# EAGLE schematic sunbeam2 (EAGLE 6.0)
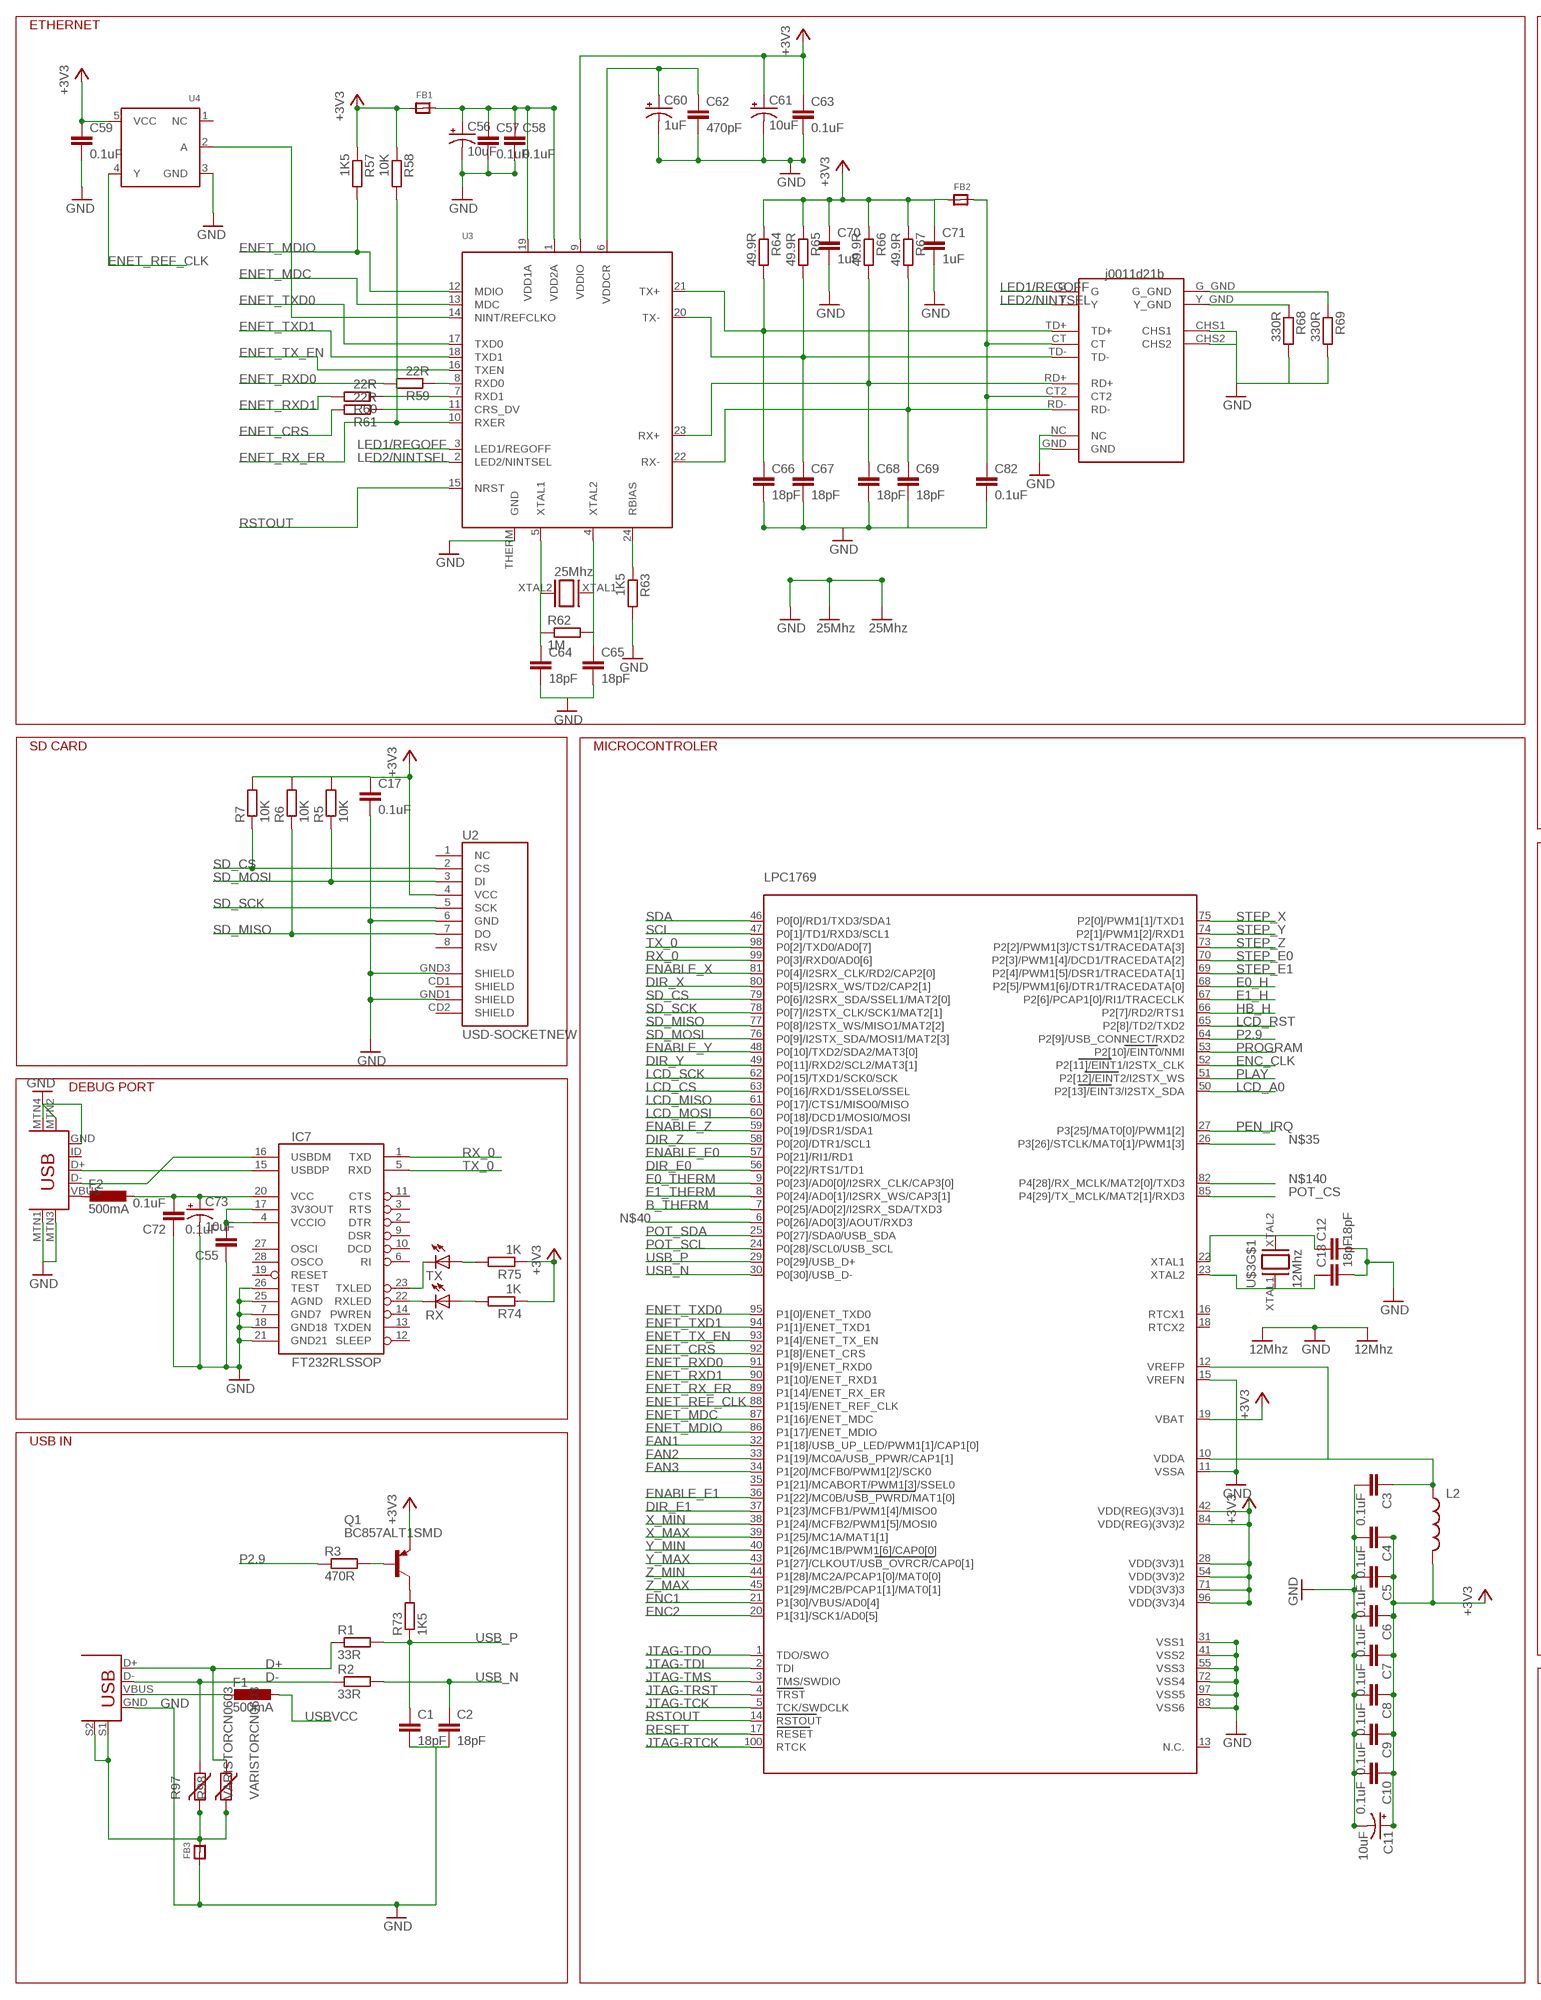
[diagram p0: schematic, sheet 1, part 1 of 2]
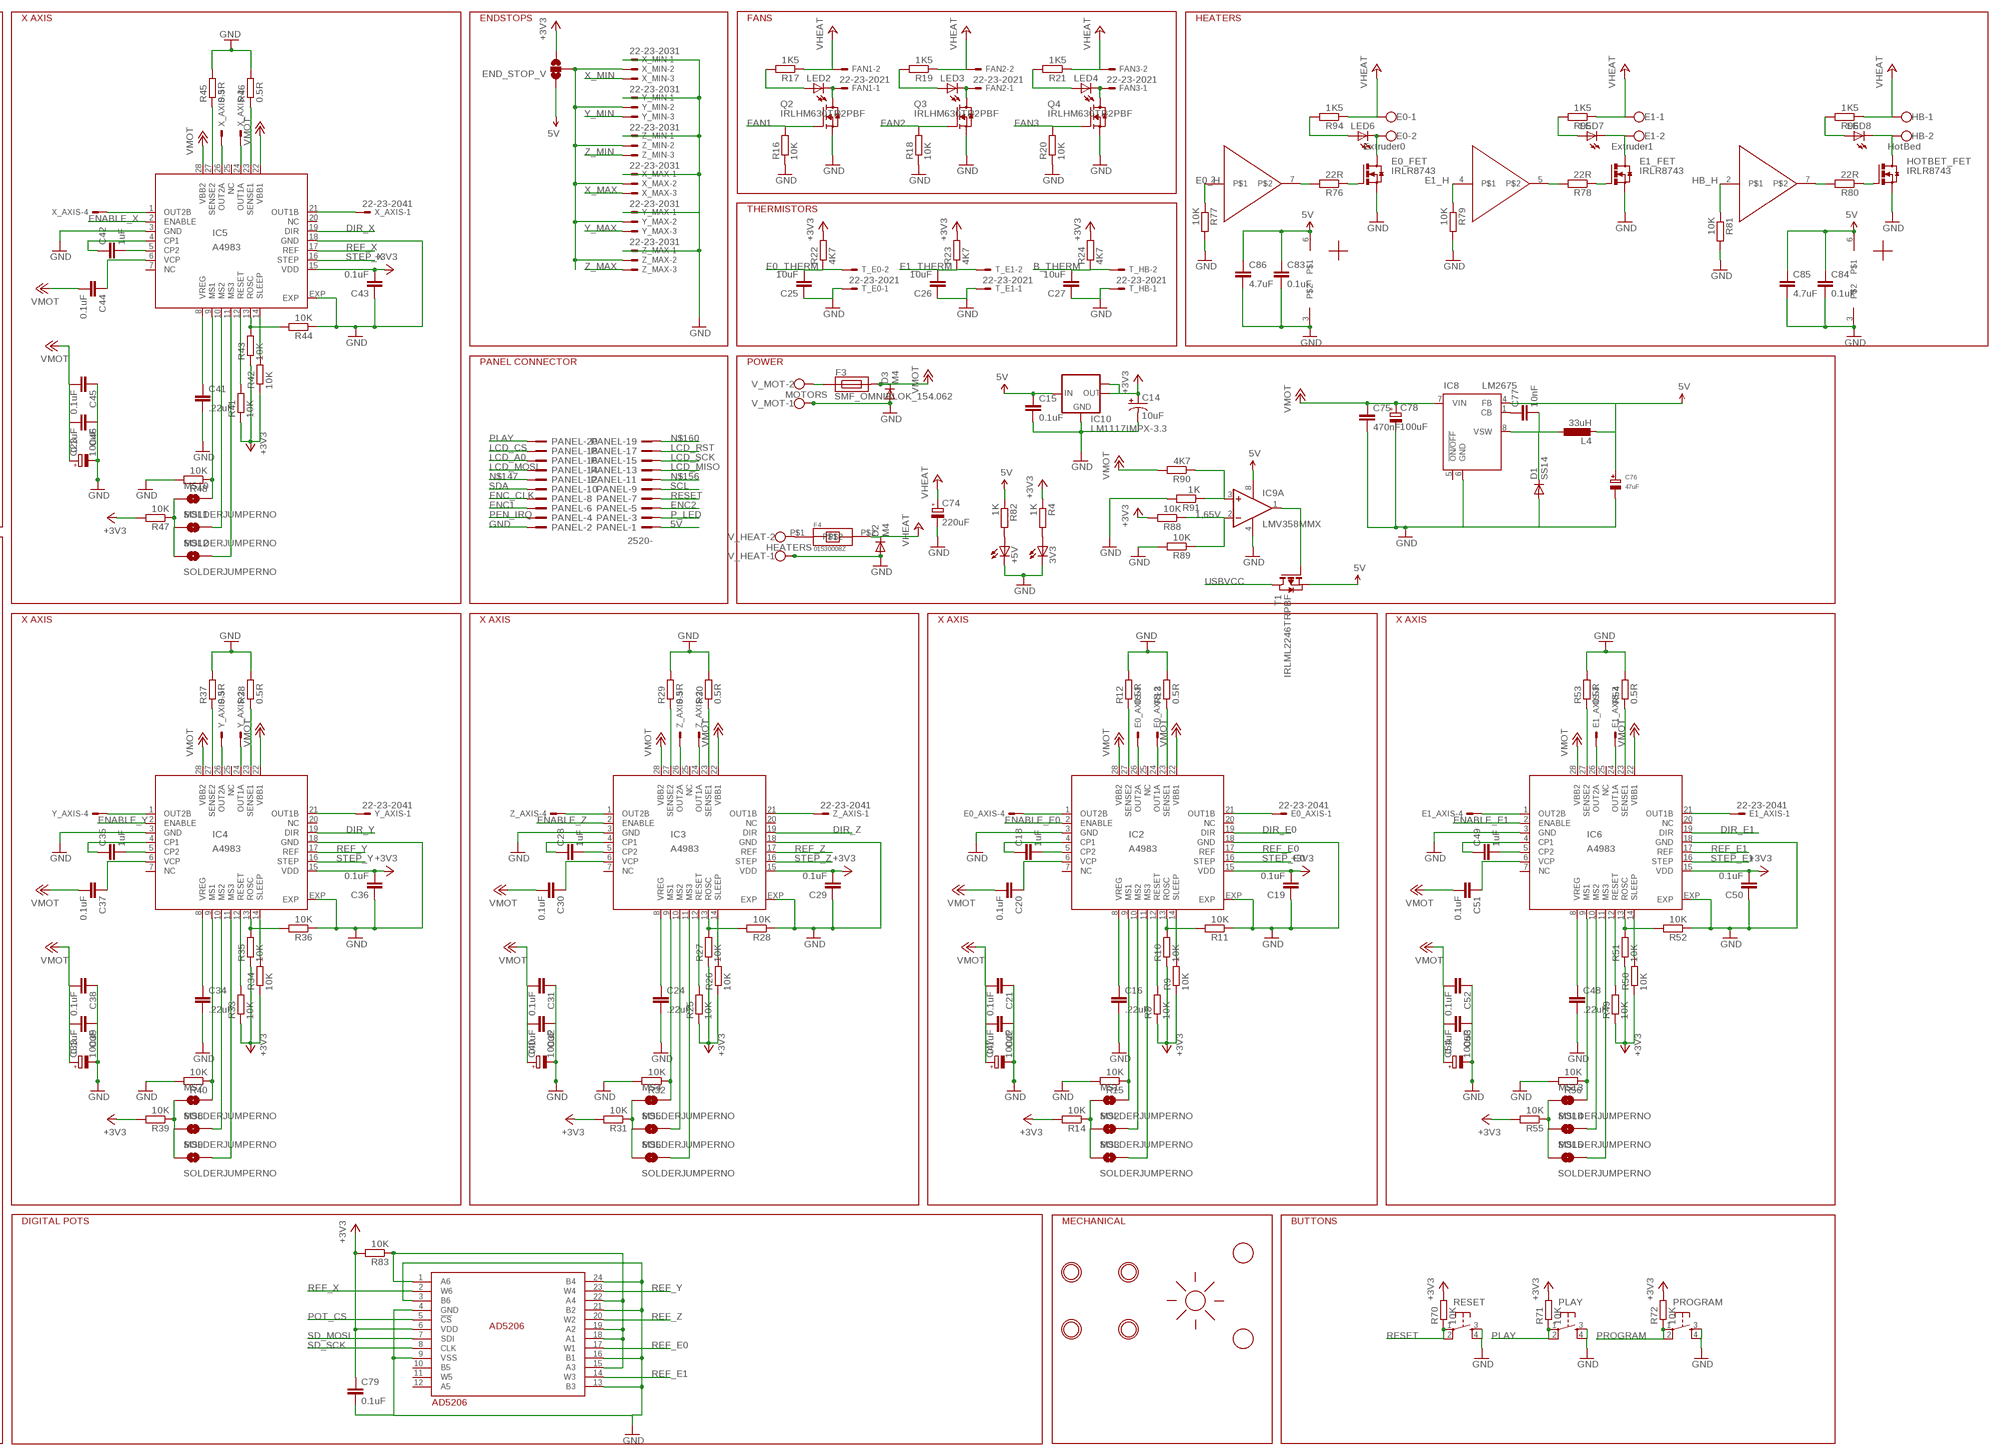
[diagram p1: schematic, sheet 1, part 2 of 2]

## Parts
3V3  LEDCHIPLED_0805  [CHIPLED_0805]
+5V  LEDCHIPLED_0805  [CHIPLED_0805]
AD5206  AD5206  [TSSOP24]
C1  18pF  C-EUC0603  [C0603]
C2  18pF  C-EUC0603  [C0603]
C3  0.1uF  C-EUC0603  [C0603]
C4  0.1uF  C-EUC0603  [C0603]
C5  0.1uF  C-EUC0603  [C0603]
C6  0.1uF  C-EUC0603  [C0603]
C7  0.1uF  C-EUC0603  [C0603]
C8  0.1uF  C-EUC0603  [C0603]
C9  0.1uF  C-EUC0603  [C0603]
C10  0.1uF  C-EUC0603  [C0603]
C11  10uF  CAP_POL1206  [EIA3216]
C12  18pF  C-EUC0603  [C0603]
C13  18pF  C-EUC0603  [C0603]
C14  10uF  CAP_POL1206  [EIA3216]
C15  0.1uF  C-EUC0805  [C0805]
C16  .22uF  C-EUC0603  [C0603]
C17  0.1uF  C-EUC0603  [C0603]
C18  1uF  C-EUC0603  [C0603]
C19  0.1uF  C-EUC0603  [C0603]
C20  0.1uF  C-EUC0805  [C0805]
C21  0.1uF  C-EUC0805  [C0805]
C22  0.1uF  C-EUC0805  [C0805]
C23  100uF  CPOL-EUUD-6,3X7,7  [UD-6,3X7,7_NICHICON]
C24  .22uF  C-EUC0603  [C0603]
C25  10uF  C-EUC0603  [C0603]
C26  10uF  C-EUC0603  [C0603]
C27  10uF  C-EUC0603  [C0603]
C28  1uF  C-EUC0603  [C0603]
C29  0.1uF  C-EUC0603  [C0603]
C30  0.1uF  C-EUC0805  [C0805]
C31  0.1uF  C-EUC0805  [C0805]
C32  0.1uF  C-EUC0805  [C0805]
C33  100uF  CPOL-EUUD-6,3X7,7  [UD-6,3X7,7_NICHICON]
C34  .22uF  C-EUC0603  [C0603]
C35  1uF  C-EUC0603  [C0603]
C36  0.1uF  C-EUC0603  [C0603]
C37  0.1uF  C-EUC0805  [C0805]
C38  0.1uF  C-EUC0805  [C0805]
C39  0.1uF  C-EUC0805  [C0805]
C40  100uF  CPOL-EUUD-6,3X7,7  [UD-6,3X7,7_NICHICON]
C41  .22uF  C-EUC0603  [C0603]
C42  1uF  C-EUC0603  [C0603]
C43  0.1uF  C-EUC0603  [C0603]
C44  0.1uF  C-EUC0805  [C0805]
C45  0.1uF  C-EUC0805  [C0805]
C46  0.1uF  C-EUC0805  [C0805]
C47  100uF  CPOL-EUUD-6,3X7,7  [UD-6,3X7,7_NICHICON]
C48  .22uF  C-EUC0603  [C0603]
C49  1uF  C-EUC0603  [C0603]
C50  0.1uF  C-EUC0603  [C0603]
C51  0.1uF  C-EUC0805  [C0805]
C52  0.1uF  C-EUC0805  [C0805]
C53  0.1uF  C-EUC0805  [C0805]
C54  100uF  CPOL-EUUD-6,3X7,7  [UD-6,3X7,7_NICHICON]
C55  0.1uF  C-EUC0603  [C0603]
C56  10uF  CAP_POL1206  [EIA3216]
C57  0.1uF  C-EUC0603  [C0603]
C58  0.1uF  C-EUC0603  [C0603]
C59  0.1uF  C-EUC0603  [C0603]
C60  1uF  CAP_POL1206  [EIA3216]
C61  10uF  CAP_POL1206  [EIA3216]
C62  470pF  C-EUC0603  [C0603]
C63  0.1uF  C-EUC0603  [C0603]
C64  18pF  C-EUC0603  [C0603]
C65  18pF  C-EUC0603  [C0603]
C66  18pF  C-EUC0603  [C0603]
C67  18pF  C-EUC0603  [C0603]
C68  18pF  C-EUC0603  [C0603]
C69  18pF  C-EUC0603  [C0603]
C70  1uF  C-EUC0603  [C0603]
C71  1uF  C-EUC0603  [C0603]
C72  0.1uF  C-EUC0603  [C0603]
C73  10uF  CAP_POL1206  [EIA3216]
C74  220uF  CPOL-EUUD-8X10  [UD-8X10_NICHICON]
C75  470nF  C-EUC0805  [C0805]
C76  47uF  CAP_TANTALUMD/7343_REFLOW  [EIA7343-31/D-R]
C77  10nF  C-EUC0805  [C0805]
C78  100uF  CPOL-EUUD-8X10  [UD-8X10_NICHICON]
C79  0.1uF  C-EUC0603  [C0603]
C82  0.1uF  C-EUC0603  [C0603]
C83  0.1uF  C-EUC0603  [C0603]
C84  0.1uF  C-EUC0603  [C0603]
C85  4.7uF  C-EUC0603  [C0603]
C86  4.7uF  C-EUC0603  [C0603]
D1  SS14  DIODE-DO214AC  [DO214AC]
D2  M4  DIODE-DO214AC  [DO214AC]
D3  M4  DIODE-DO214AC  [DO214AC]
E0  Extruder0  W237-102  [W237-102]
E0_AXIS  22-23-2041  [22-23-2041]
E0_FET  IRLR8743  [D-PAK_TO252AA]
E1  Extruder1  W237-102  [W237-102]
E1_AXIS  22-23-2041  [22-23-2041]
E1_FET  IRLR8743  [D-PAK_TO252AA]
END_STOP_V  SOLDERJUMPER_2WAYS  [SJ_3]
F1  500mA  L-EUL1812  [L1812]
F2  500mA  L-EUL1812  [L1812]
F3  SMF_OMNIBLOK_154.062  [NANO2_SMF_FUSEBLOCK]
F4  01530008Z  [01530008Z]
FAN1  22-23-2021  [22-23-2021]
FAN2  22-23-2021  [22-23-2021]
FAN3  22-23-2021  [22-23-2021]
FB1  FERRITE_0603  [_0603]
FB2  FERRITE_0603  [_0603]
FB3  FERRITE_0603  [_0603]
FET_DRV1  TC4427  [SOIC8]
FET_DRV2  TC4427  [SOIC8]
GND  MOUNTINGHOLE3.0THIN  [MOUNTINGHOLE_3.0_PLATEDTHIN]
HB  HotBed  W237-102  [W237-102]
HOTBET_FET  IRLR8743  [D-PAK_TO252AA]
IC2  A4983  [QFN28ET]
IC3  A4983  [QFN28ET]
IC4  A4983  [QFN28ET]
IC5  A4983  [QFN28ET]
IC6  A4983  [QFN28ET]
IC7  FT232RLSSOP  [SSOP28DB]
IC8  LM2675  [SO08]
IC9  LMV358MMX  [MSOP08]
IC10  LM1117IMPX-3.3  [SOT223]
L2  INDUCTOR0603  [0603]
L4  33uH  L-EUPIS2816  [PIS2816]
LED2  LEDCHIPLED_0805  [CHIPLED_0805]
LED3  LEDCHIPLED_0805  [CHIPLED_0805]
LED4  LEDCHIPLED_0805  [CHIPLED_0805]
LED6  LEDCHIPLED_0805  [CHIPLED_0805]
LED7  LEDCHIPLED_0805  [CHIPLED_0805]
LED8  LEDCHIPLED_0805  [CHIPLED_0805]
LPC1769  LPC1768  [LQFP100]
MS1  SOLDERJUMPERNO  [SJ_2S-NO]
MS2  SOLDERJUMPERNO  [SJ_2S-NO]
MS3  SOLDERJUMPERNO  [SJ_2S-NO]
MS4  SOLDERJUMPERNO  [SJ_2S-NO]
MS5  SOLDERJUMPERNO  [SJ_2S-NO]
MS6  SOLDERJUMPERNO  [SJ_2S-NO]
MS7  SOLDERJUMPERNO  [SJ_2S-NO]
MS8  SOLDERJUMPERNO  [SJ_2S-NO]
MS9  SOLDERJUMPERNO  [SJ_2S-NO]
MS10  SOLDERJUMPERNO  [SJ_2S-NO]
MS11  SOLDERJUMPERNO  [SJ_2S-NO]
MS12  SOLDERJUMPERNO  [SJ_2S-NO]
MS13  SOLDERJUMPERNO  [SJ_2S-NO]
MS14  SOLDERJUMPERNO  [SJ_2S-NO]
MS15  SOLDERJUMPERNO  [SJ_2S-NO]
PANEL  2520-  [PAK100/2500-20]
PLAY  TAC_SWITCHSMD  [TACTILE_SWITCH_SMD]
PROGRAM  TAC_SWITCHSMD  [TACTILE_SWITCH_SMD]
Q1  BC857ALT1SMD  [SOT23-BEC]
Q2  IRLHM630TR2PBF  IRLHM630PBF  [PQFN33]
Q3  IRLHM630TR2PBF  IRLHM630PBF  [PQFN33]
Q4  IRLHM630TR2PBF  IRLHM630PBF  [PQFN33]
R1  33R  R-EU_R0603  [R0603]
R2  33R  R-EU_R0603  [R0603]
R3  470R  R-EU_R0603  [R0603]
R4  1K  R-EU_R0603  [R0603]
R5  10K  R-EU_R0603  [R0603]
R6  10K  R-EU_R0603  [R0603]
R7  10K  R-EU_R0603  [R0603]
R8  10K  R-EU_R0603  [R0603]
R9  10K  R-EU_R0603  [R0603]
R10  10K  R-EU_R0603  [R0603]
R11  10K  R-EU_R0603  [R0603]
R12  0.5R  R-EU_R2512  [R2512]
R13  0.5R  R-EU_R2512  [R2512]
R14  10K  R-EU_R0603  [R0603]
R15  10K  R-EU_R0603  [R0603]
R16  10K  R-EU_R0603  [R0603]
R17  1K5  R-EU_R0603  [R0603]
R18  10K  R-EU_R0603  [R0603]
R19  1K5  R-EU_R0603  [R0603]
R20  10K  R-EU_R0603  [R0603]
R21  1K5  R-EU_R0603  [R0603]
R22  4K7  R-EU_R0603  [R0603]
R23  4K7  R-EU_R0603  [R0603]
R24  4K7  R-EU_R0603  [R0603]
R25  10K  R-EU_R0603  [R0603]
R26  10K  R-EU_R0603  [R0603]
R27  10K  R-EU_R0603  [R0603]
R28  10K  R-EU_R0603  [R0603]
R29  0.5R  R-EU_R2512  [R2512]
R30  0.5R  R-EU_R2512  [R2512]
R31  10K  R-EU_R0603  [R0603]
R32  10K  R-EU_R0603  [R0603]
R33  10K  R-EU_R0603  [R0603]
R34  10K  R-EU_R0603  [R0603]
R35  10K  R-EU_R0603  [R0603]
R36  10K  R-EU_R0603  [R0603]
R37  0.5R  R-EU_R2512  [R2512]
R38  0.5R  R-EU_R2512  [R2512]
R39  10K  R-EU_R0603  [R0603]
R40  10K  R-EU_R0603  [R0603]
R41  10K  R-EU_R0603  [R0603]
R42  10K  R-EU_R0603  [R0603]
R43  10K  R-EU_R0603  [R0603]
R44  10K  R-EU_R0603  [R0603]
R45  0.5R  R-EU_R2512  [R2512]
R46  0.5R  R-EU_R2512  [R2512]
R47  10K  R-EU_R0603  [R0603]
R48  10K  R-EU_R0603  [R0603]
R49  10K  R-EU_R0603  [R0603]
R50  10K  R-EU_R0603  [R0603]
R51  10K  R-EU_R0603  [R0603]
R52  10K  R-EU_R0603  [R0603]
R53  0.5R  R-EU_R2512  [R2512]
R54  0.5R  R-EU_R2512  [R2512]
R55  10K  R-EU_R0603  [R0603]
R56  10K  R-EU_R0603  [R0603]
R57  1K5  R-EU_R0603  [R0603]
R58  10K  R-EU_R0603  [R0603]
R59  22R  R-EU_R0603  [R0603]
R60  22R  R-EU_R0603  [R0603]
R61  22R  R-EU_R0603  [R0603]
R62  1M  R-EU_R0603  [R0603]
R63  1K5  R-EU_R0603  [R0603]
R64  49.9R  R-EU_R0603  [R0603]
R65  49.9R  R-EU_R0603  [R0603]
R66  49.9R  R-EU_R0603  [R0603]
R67  49.9R  R-EU_R0603  [R0603]
R68  330R  R-EU_R0603  [R0603]
R69  330R  R-EU_R0603  [R0603]
R70  10K  R-EU_R0603  [R0603]
R71  10K  R-EU_R0603  [R0603]
R72  10K  R-EU_R0603  [R0603]
R73  1K5  R-EU_R0603  [R0603]
R74  1K  R-EU_R0603  [R0603]
R75  1K  R-EU_R0603  [R0603]
R76  22R  R-EU_R0603  [R0603]
R77  10K  R-EU_R0603  [R0603]
R78  22R  R-EU_R0603  [R0603]
R79  10K  R-EU_R0603  [R0603]
R80  22R  R-EU_R0603  [R0603]
R81  10K  R-EU_R0603  [R0603]
R82  1K  R-EU_R0603  [R0603]
R83  10K  R-EU_R0603  [R0603]
R88  10K  R-EU_R0603  [R0603]
R89  10K  R-EU_R0603  [R0603]
R90  4K7  R-EU_R0603  [R0603]
R91  1K  R-EU_R0603  [R0603]
R94  1K5  R-EU_R0603  [R0603]
R95  1K5  R-EU_R0603  [R0603]
R96  1K5  R-EU_R0603  [R0603]
R97  VARISTORCN0603  [CT/CN0603]
R98  VARISTORCN0603  [CT/CN0603]
RESET  TAC_SWITCHSMD  [TACTILE_SWITCH_SMD]
RJ1  ETHERNET  J0011D21B  [J0011D21B]
RX  LEDCHIPLED_0805  [CHIPLED_0805]
T1  IRLML2246TRPBF  PMOSSOT23  [SOT-23]
T_E0  22-23-2021  [22-23-2021]
T_E1  22-23-2021  [22-23-2021]
T_HB  22-23-2021  [22-23-2021]
TX  LEDCHIPLED_0805  [CHIPLED_0805]
U2  USD-SOCKETNEW  [MICRO-SD-SOCKET-PP]
U3  LAN8720  [QFN24_4MM]
U4  74LVC1G04  [SOT23-5]
U$1  USB+SHIELD  [USB-B-PTH]
U$3  12Mhz  CRYSTAL2734  [CRYSTAL2734]
U$7  USB-MINIB-5PIN  [USB-MINIB]
U$8  25Mhz  CRYSTAL2734  [CRYSTAL2734]
U$17  MOUNTINGHOLE3.0THIN  [MOUNTINGHOLE_3.0_PLATEDTHIN]
U$18  MOUNTINGHOLE3.0THIN  [MOUNTINGHOLE_3.0_PLATEDTHIN]
U$20  MOUNTINGHOLE3.0THIN  [MOUNTINGHOLE_3.0_PLATEDTHIN]
U$21  SUNLOGO  [SUN]
U$22  FIDUCIAL  [FIDUCIAL_1MM]
U$23  FIDUCIAL  [FIDUCIAL_1MM]
V_HEAT  HEATERS  W237-102  [W237-102]
V_MOT  MOTORS  W237-102  [W237-102]
X_AXIS  22-23-2041  [22-23-2041]
X_MAX  22-23-2031  [22-23-2031]
X_MIN  22-23-2031  [22-23-2031]
Y_AXIS  22-23-2041  [22-23-2041]
Y_MAX  22-23-2031  [22-23-2031]
Y_MIN  22-23-2031  [22-23-2031]
Z_AXIS  22-23-2041  [22-23-2041]
Z_MAX  22-23-2031  [22-23-2031]
Z_MIN  22-23-2031  [22-23-2031]

## Nets
1,65V: IC9.2(A:-IN) R88.1 R89.1
5V: C15.1 C76.+ C83.1 C84.1 C85.1 C86.1 END_STOP_V.1 FET_DRV1.6 FET_DRV2.6 IC8.4(FB) IC9.8(P:V+) IC10.3(IN) L4.2 PANEL.1 R82.1 T1.2(S)
+3V3: AD5206.6(VDD) C4.1 C5.1 C6.1 C7.1 C8.1 C9.1 C10.1 C11.A(+) C14.A(+) C17.1 C19.2 C29.2 C36.2 C43.2 C50.2 C59.1 C61.A(+) C63.1 C70.1 C71.1 C79.1 END_STOP_V.3 FB1.1 FB2.1 IC2.15(VDD) IC3.15(VDD) IC4.15(VDD) IC5.15(VDD) IC6.15(VDD) IC10.2(OUT) IC10.TAB(OUT1) L2.2 LPC1769.19(VBAT) LPC1769.28(VDD(3V3)1) LPC1769.42(VDD(REG)(3V3)1) LPC1769.54(VDD(3V3)2) LPC1769.71(VDD(3V3)3) LPC1769.84(VDD(REG)(3V3)2) LPC1769.96(VDD(3V3)4) Q1.E R4.1 R5.2 R6.2 R7.2 R8.1 R9.1 R10.1 R14.2 R22.2 R23.2 R24.2 R25.1 R26.1 R27.1 R31.2 R33.1 R34.1 R35.1 R39.2 R41.1 R42.1 R43.1 R47.2 R49.1 R50.1 R51.1 R55.2 R57.1 R58.1 R64.1 R65.1 R66.1 R67.1 R70.2 R71.2 R72.2 R74.1 R75.1 R83.2 R88.2 U2.4(VCC) U3.9(VDDIO) U4.5(VCC)
+12V: C20.2 C21.2 C22.2 C23.+ C30.2 C31.2 C32.2 C33.+ C37.2 C38.2 C39.2 C40.+ C44.2 C45.2 C46.2 C47.+ C51.2 C52.2 C53.2 C54.+ C75.1 C78.+ D3.C F3.2 IC2.22(VBB1) IC2.28(VBB2) IC3.22(VBB1) IC3.28(VBB2) IC4.22(VBB1) IC4.28(VBB2) IC5.22(VBB1) IC5.28(VBB2) IC6.22(VBB1) IC6.28(VBB2) IC8.7(VIN) R90.2 ; supply symbol labelled VMOT
B_THERM: C27.2 LPC1769.7(P0[25]/AD0[2]/I2SRX_SDA/TXD3) R24.1 T_HB.2
D+: R1.1 R98.1 U$1.D+
D-: R2.1 R97.1 U$1.D-
DIR_E0: IC2.19(DIR) LPC1769.56(P0[22]/RTS1/TD1)
DIR_E1: IC6.19(DIR) LPC1769.37(P1[23]/MCFB1/PWM1[4]/MISO0)
DIR_X: IC5.19(DIR) LPC1769.80(P0[5]/I2SRX_WS/TD2/CAP2[1])
DIR_Y: IC4.19(DIR) LPC1769.49(P0[11]/RXD2/SCL2/MAT3[1])
DIR_Z: IC3.19(DIR) LPC1769.58(P0[20]/DTR1/SCL1)
E0_H: FET_DRV1.2 LPC1769.68(P2[5]/PWM1[6]/DTR1/TRACEDATA[0]) R77.1
E0_THERM: C25.2 LPC1769.9(P0[23]/AD0[0]/I2SRX_CLK/CAP3[0]) R22.1 T_E0.2
E1_H: FET_DRV1.4 LPC1769.67(P2[6]/PCAP1[0]/RI1/TRACECLK) R79.1
E1_THERM: C26.2 LPC1769.8(P0[24]/AD0[1]/I2SRX_WS/CAP3[1]) R23.1 T_E1.2
ENABLE_E0: IC2.2(ENABLE) LPC1769.57(P0[21]/RI1/RD1)
ENABLE_E1: IC6.2(ENABLE) LPC1769.36(P1[22]/MC0B/USB_PWRD/MAT1[0])
ENABLE_X: IC5.2(ENABLE) LPC1769.81(P0[4]/I2SRX_CLK/RD2/CAP2[0])
ENABLE_Y: IC4.2(ENABLE) LPC1769.48(P0[10]/TXD2/SDA2/MAT3[0])
ENABLE_Z: IC3.2(ENABLE) LPC1769.59(P0[19]/DSR1/SDA1)
ENC1: LPC1769.21(P1[30]/VBUS/AD0[4]) PANEL.6
ENC2: LPC1769.20(P1[31]/SCK1/AD0[5]) PANEL.5
ENC_CLK: LPC1769.52(P2[11]/EINT1/I2STX_CLK) PANEL.8
ENET_CRS: LPC1769.92(P1[8]/ENET_CRS) R61.2
ENET_MDC: LPC1769.87(P1[16]/ENET_MDC) U3.13(MDC)
ENET_MDIO: LPC1769.86(P1[17]/ENET_MDIO) R57.2 U3.12(MDIO)
ENET_REF_CLK: LPC1769.88(P1[15]/ENET_REF_CLK) U4.4(Y)
ENET_RX_ER: LPC1769.89(P1[14]/ENET_RX_ER) R58.2 U3.10(RXER)
ENET_RXD0: LPC1769.91(P1[9]/ENET_RXD0) R59.2
ENET_RXD1: LPC1769.90(P1[10]/ENET_RXD1) R60.2
ENET_TX_EN: LPC1769.93(P1[4]/ENET_TX_EN) U3.16(TXEN)
ENET_TXD0: LPC1769.95(P1[0]/ENET_TXD0) U3.17(TXD0)
ENET_TXD1: LPC1769.94(P1[1]/ENET_TXD1) U3.18(TXD1)
FAN1: LPC1769.32(P1[18]/USB_UP_LED/PWM1[1]/CAP1[0]) Q2.G R16.2
FAN2: LPC1769.33(P1[19]/MC0A/USB_PPWR/CAP1[1]) Q3.G R18.2
FAN3: LPC1769.34(P1[20]/MCFB0/PWM1[2]/SCK0) Q4.G R20.2
GND: 3V3.C +5V.C AD5206.3(B6) AD5206.4(GND) AD5206.9(VSS) AD5206.13(B3) AD5206.16(B1) AD5206.21(B2) AD5206.24(B4) C1.2 C2.2 C3.2 C4.2 C5.2 C6.2 C7.2 C8.2 C9.2 C10.2 C11.C(-) C12.2 C13.2 C14.C(-) C15.2 C16.2 C17.2 C19.1 C21.1 C22.1 C23.- C24.2 C25.1 C26.1 C27.1 C29.1 C31.1 C32.1 C33.- C34.2 C36.1 C38.1 C39.1 C40.- C41.2 C43.1 C45.1 C46.1 C47.- C48.2 C50.1 C52.1 C53.1 C54.- C55.1 C56.C(-) C57.2 C58.2 C59.2 C60.C(-) C61.C(-) C62.2 C63.2 C64.2 C65.2 C66.2 C67.2 C68.2 C69.2 C70.2 C71.2 C72.1 C73.C(-) C74.- C75.2 C76.- C78.- C79.2 C82.2 C83.2 C84.2 C85.2 C86.2 D1.A D2.A D3.A E0_FET.3(S) E1_FET.3(S) FB3.1 FET_DRV1.3 FET_DRV2.3 HOTBET_FET.3(S) IC2.3(GND) IC2.18(GND) IC2.EXP IC3.3(GND) IC3.18(GND) IC3.EXP IC4.3(GND) IC4.18(GND) IC4.EXP IC5.3(GND) IC5.18(GND) IC5.EXP IC6.3(GND) IC6.18(GND) IC6.EXP IC7.7(GND7) IC7.18(GND18) IC7.21(GND21) IC7.25(AGND) IC7.26(TEST) IC8.6(GND) IC9.4(P:V-) IC10.1(GND) LPC1769.11(VSSA) LPC1769.15(VREFN) LPC1769.31(VSS1) LPC1769.41(VSS2) LPC1769.55(VSS3) LPC1769.72(VSS4) LPC1769.83(VSS6) LPC1769.97(VSS5) PANEL.2 PLAY.3 PLAY.4 PROGRAM.3 PROGRAM.4 Q2.S Q3.S Q4.S R11.1 R12.2 R13.2 R15.2 R16.1 R18.1 R20.1 R28.1 R29.2 R30.2 R32.2 R36.1 R37.2 R38.2 R40.2 R44.1 R45.2 R46.2 R48.2 R52.1 R53.2 R54.2 R56.2 R63.2 R68.2 R69.2 R77.2 R79.2 R81.2 R89.2 R91.2 RESET.3 RESET.4 RJ1.CHS1 RJ1.CHS2 RJ1.GND RJ1.NC T_E0.1 T_E1.1 T_HB.1 U2.6(GND) U2.GND1(SHIELD) U2.GND3(SHIELD) U3.THERM(GND) U4.3(GND) U$1.GND U$3.GND1(GND) U$3.GND2(GND) U$7.GND U$7.MTN1(MTN2) U$7.MTN2(MTN3) U$7.MTN3(MTN1) U$7.MTN4 U$8.GND1(GND) U$8.GND2(GND) V_HEAT.1 V_MOT.1 X_MAX.1 X_MIN.1 Y_MAX.1 Y_MIN.1 Z_MAX.1 Z_MIN.1
HB_H: FET_DRV2.2 LPC1769.66(P2[7]/RD2/RTS1) R81.1
JTAG-RTCK: LPC1769.100(RTCK)
JTAG-TCK: LPC1769.5(TCK/SWDCLK)
JTAG-TDI: LPC1769.2(TDI)
JTAG-TDO: LPC1769.1(TDO/SWO)
JTAG-TMS: LPC1769.3(TMS/SWDIO)
JTAG-TRST: LPC1769.4(TRST)
LCD_A0: LPC1769.50(P2[13]/EINT3/I2STX_SDA) PANEL.16
LCD_CS: LPC1769.63(P0[16]/RXD1/SSEL0/SSEL) PANEL.18
LCD_MISO: LPC1769.61(P0[17]/CTS1/MISO0/MISO) PANEL.13
LCD_MOSI: LPC1769.60(P0[18]/DCD1/MOSI0/MOSI) PANEL.14
LCD_RST: LPC1769.65(P2[8]/TD2/TXD2) PANEL.17
LCD_SCK: LPC1769.62(P0[15]/TXD1/SCK0/SCK) PANEL.15
LED1/REGOFF: RJ1.G U3.3(LED1/REGOFF)
LED2/NINTSEL: RJ1.Y U3.2(LED2/NINTSEL)
N$1: F1.2 U$1.VBUS
N$2: Q1.B R3.2
N$3: FB3.2 R97.2 R98.2 U$1.S1 U$1.S2
N$4: FAN1.1 LED2.C Q2.D
N$5: FAN2.1 LED3.C Q3.D
N$6: C13.1 LPC1769.23(XTAL2) U$3.XTAL1
N$7: C12.1 LPC1769.22(XTAL1) U$3.XTAL2
N$8: E0_AXIS.1 IC2.21(OUT1B)
N$9: E0_AXIS.2 IC2.24(OUT1A)
N$10: 3V3.A R4.2
N$11: C3.1 L2.1 LPC1769.10(VDDA) LPC1769.12(VREFP)
N$12: E0_AXIS.3 IC2.26(OUT2A)
N$13: E0_AXIS.4 IC2.1(OUT2B)
N$14: IC2.12(RESET) R8.2
N$15: IC2.14(SLEEP) R9.2
N$16: IC2.13(ROSC) R10.2 R11.2
N$17: C16.1 IC2.8(VREG)
N$18: C18.2 IC2.5(CP2)
N$19: C18.1 IC2.4(CP1)
N$20: IC2.27(SENSE2) R12.1
N$21: IC2.23(SENSE1) R13.1
N$22: C20.1 IC2.6(VCP)
N$23: IC2.9(MS1) MS1.2 R15.1
N$24: IC2.10(MS2) MS2.2
N$25: IC2.11(MS3) MS3.2
N$26: MS1.1 MS2.1 MS3.1 R14.1
N$27: F3.1 V_MOT.2
N$28: HB.2 HOTBET_FET.4(D) LED8.C
N$29: E1.2 E1_FET.4(D) LED7.C
N$30: E0.2 E0_FET.4(D) LED6.C
N$31: E0_FET.1(G) R76.1
N$32: E1_FET.1(G) R78.1
N$33: FET_DRV1.7 R76.2
N$34: LED6.A R94.2
N$35: LPC1769.26(P3[26]/STCLK/MAT0[1]/PWM1[3])
N$36: Q1.C R73.2
N$37: IC3.21(OUT1B) Z_AXIS.1
N$38: IC3.24(OUT1A) Z_AXIS.2
N$39: IC3.26(OUT2A) Z_AXIS.3
N$40: LPC1769.6(P0[26]/AD0[3]/AOUT/RXD3)
N$41: IC3.1(OUT2B) Z_AXIS.4
N$42: LED3.A R19.2
N$43: END_STOP_V.2 X_MAX.2 X_MIN.2 Y_MAX.2 Y_MIN.2 Z_MAX.2 Z_MIN.2
N$44: LED2.A R17.2
N$45: FAN3.1 LED4.C Q4.D
N$46: LED4.A R21.2
N$47: IC3.12(RESET) R25.2
N$48: IC3.14(SLEEP) R26.2
N$49: IC3.13(ROSC) R27.2 R28.2
N$50: C24.1 IC3.8(VREG)
N$51: C28.2 IC3.5(CP2)
N$52: C28.1 IC3.4(CP1)
N$53: IC3.27(SENSE2) R29.1
N$54: IC3.23(SENSE1) R30.1
N$55: C30.1 IC3.6(VCP)
N$56: IC3.9(MS1) MS4.2 R32.1
N$57: IC3.10(MS2) MS5.2
N$58: IC3.11(MS3) MS6.2
N$59: MS4.1 MS5.1 MS6.1 R31.1
N$60: IC4.21(OUT1B) Y_AXIS.1
N$61: IC4.24(OUT1A) Y_AXIS.2
N$62: IC4.26(OUT2A) Y_AXIS.3
N$63: IC4.1(OUT2B) Y_AXIS.4
N$64: IC4.12(RESET) R33.2
N$65: IC4.14(SLEEP) R34.2
N$66: IC4.13(ROSC) R35.2 R36.2
N$67: C34.1 IC4.8(VREG)
N$68: C35.2 IC4.5(CP2)
N$69: C35.1 IC4.4(CP1)
N$70: IC4.27(SENSE2) R37.1
N$71: IC4.23(SENSE1) R38.1
N$72: C37.1 IC4.6(VCP)
N$73: IC4.9(MS1) MS7.2 R40.1
N$74: IC4.10(MS2) MS8.2
N$75: IC4.11(MS3) MS9.2
N$76: MS7.1 MS8.1 MS9.1 R39.1
N$77: IC5.21(OUT1B) X_AXIS.1
N$78: IC5.24(OUT1A) X_AXIS.2
N$79: IC5.26(OUT2A) X_AXIS.3
N$80: IC5.1(OUT2B) X_AXIS.4
N$81: IC5.12(RESET) R41.2
N$82: IC5.14(SLEEP) R42.2
N$83: IC5.13(ROSC) R43.2 R44.2
N$84: C41.1 IC5.8(VREG)
N$85: C42.2 IC5.5(CP2)
N$86: C42.1 IC5.4(CP1)
N$87: IC5.27(SENSE2) R45.1
N$88: IC5.23(SENSE1) R46.1
N$89: C44.1 IC5.6(VCP)
N$90: IC5.9(MS1) MS10.2 R48.1
N$91: IC5.10(MS2) MS11.2
N$92: IC5.11(MS3) MS12.2
N$93: MS10.1 MS11.1 MS12.1 R47.1
N$94: E1_AXIS.1 IC6.21(OUT1B)
N$95: E1_AXIS.2 IC6.24(OUT1A)
N$96: E1_AXIS.3 IC6.26(OUT2A)
N$97: E1_AXIS.4 IC6.1(OUT2B)
N$98: IC6.12(RESET) R49.2
N$99: IC6.14(SLEEP) R50.2
N$100: IC6.13(ROSC) R51.2 R52.2
N$101: C48.1 IC6.8(VREG)
N$102: C49.2 IC6.5(CP2)
N$103: C49.1 IC6.4(CP1)
N$104: IC6.27(SENSE2) R53.1
N$105: IC6.23(SENSE1) R54.1
N$106: C51.1 IC6.6(VCP)
N$107: IC6.9(MS1) MS13.2 R56.1
N$108: IC6.10(MS2) MS14.2
N$109: IC6.11(MS3) MS15.2
N$110: MS13.1 MS14.1 MS15.1 R55.1
N$111: F2.2 U$7.VBUS
N$112: IC7.15(USBDP) U$7.D+
N$113: IC7.16(USBDM) U$7.D-
N$114: C72.2 C73.A(+) F2.1 IC7.20(VCC)
N$115: C55.2 IC7.4(VCCIO) IC7.17(3V3OUT)
N$116: IC7.22(RXLED) RX.C
N$117: F4.P$1 V_HEAT.2
N$119: C56.A(+) C57.1 C58.1 FB1.2 U3.1(VDD2A) U3.19(VDD1A)
N$120: R63.1 U3.24(RBIAS)
N$121: R74.2 RX.A
N$122: U3.14(NINT/REFCLKO) U4.2(A)
N$123: R59.1 U3.8(RXD0)
N$124: R60.1 U3.7(RXD1)
N$125: R61.1 U3.11(CRS_DV)
N$126: C65.1 R62.2 U3.4(XTAL2) U$8.XTAL1
N$129: C66.1 R64.2 RJ1.TD+ U3.21(TX+)
N$130: C60.A(+) C62.1 U3.6(VDDCR)
N$131: C64.1 R62.1 U3.5(XTAL1) U$8.XTAL2
N$132: C67.1 R65.2 RJ1.TD- U3.20(TX-)
N$133: IC7.23(TXLED) TX.C
N$134: R75.2 TX.A
N$135: FET_DRV1.5 R78.2
N$136: C77.2 D1.C IC8.8(VSW) L4.1
N$137: +5V.A R82.2
N$138: HOTBET_FET.1(G) R80.1
N$139: FET_DRV2.7 R80.2
N$140: LPC1769.82(P4[28]/RX_MCLK/MAT2[0]/TXD3)
N$141: C69.1 R67.2 RJ1.RD- U3.22(RX-)
N$142: LED7.A R95.2
N$143: C77.1 IC8.1(CB)
N$144: LED8.A R96.2
N$145: C68.1 R66.2 RJ1.RD+ U3.23(RX+)
N$147: PANEL.12
N$148: AD5206.1(A6) AD5206.15(A3) AD5206.18(A1) AD5206.19(A2) AD5206.22(A4) R83.1
N$149: R68.1 RJ1.Y_GND
N$150: R69.1 RJ1.G_GND
N$151: C82.1 FB2.2 RJ1.CT RJ1.CT2
N$156: PANEL.11
N$160: PANEL.19
N$169: IC9.1(A:OUT) T1.3(G)
N$171: IC9.3(A:+IN) R90.1 R91.1
P2.9: LPC1769.64(P2[9]/USB_CONNECT/RXD2) R3.1
P_LED: PANEL.3
PEN_IRQ: LPC1769.27(P3[25]/MAT0[0]/PWM1[2]) PANEL.4
PLAY: LPC1769.51(P2[12]/EINT2/I2STX_WS) PANEL.20 PLAY.1 PLAY.2 R71.1
POT_CS: AD5206.5(!CS) LPC1769.85(P4[29]/TX_MCLK/MAT2[1]/RXD3)
POT_SCL: LPC1769.24(P0[28]/SCL0/USB_SCL)
POT_SDA: LPC1769.25(P0[27]/SDA0/USB_SDA)
PROGRAM: LPC1769.53(P2[10]/EINT0/NMI) PROGRAM.1 PROGRAM.2 R72.1
REF_E0: AD5206.17(W1) IC2.17(REF)
REF_E1: AD5206.14(W3) IC6.17(REF)
REF_X: AD5206.2(W6) IC5.17(REF)
REF_Y: AD5206.23(W4) IC4.17(REF)
REF_Z: AD5206.20(W2) IC3.17(REF)
RESET: LPC1769.17(RESET) PANEL.7 R70.1 RESET.1 RESET.2
RSTOUT: LPC1769.14(RSTOUT) U3.15(NRST)
RX_0: IC7.1(TXD) LPC1769.99(P0[3]/RXD0/AD0[6])
SCL: LPC1769.47(P0[1]/TD1/RXD3/SCL1) PANEL.9
SD_CS: LPC1769.79(P0[6]/I2SRX_SDA/SSEL1/MAT2[0]) R7.1 U2.2(CS)
SD_MISO: LPC1769.77(P0[8]/I2STX_WS/MISO1/MAT2[2]) R6.1 U2.7(DO)
SD_MOSI: AD5206.7(SDI) LPC1769.76(P0[9]/I2STX_SDA/MOSI1/MAT2[3]) R5.1 U2.3(DI)
SD_SCK: AD5206.8(CLK) LPC1769.78(P0[7]/I2STX_CLK/SCK1/MAT2[1]) U2.5(SCK)
SDA: LPC1769.46(P0[0]/RD1/TXD3/SDA1) PANEL.10
STEP_E0: IC2.16(STEP) LPC1769.70(P2[3]/PWM1[4]/DCD1/TRACEDATA[2])
STEP_E1: IC6.16(STEP) LPC1769.69(P2[4]/PWM1[5]/DSR1/TRACEDATA[1])
STEP_X: IC5.16(STEP) LPC1769.75(P2[0]/PWM1[1]/TXD1)
STEP_Y: IC4.16(STEP) LPC1769.74(P2[1]/PWM1[2]/RXD1)
STEP_Z: IC3.16(STEP) LPC1769.73(P2[2]/PWM1[3]/CTS1/TRACEDATA[3])
TX_0: IC7.5(RXD) LPC1769.98(P0[2]/TXD0/AD0[7])
USB_N: C2.1 LPC1769.30(P0[30]/USB_D-) R2.2
USB_P: C1.1 LPC1769.29(P0[29]/USB_D+) R1.2 R73.1
USBVCC: F1.1 T1.1(D)
V_EXTR: C74.+ D2.C E0.1 E1.1 F4.P$2 FAN1.2 FAN2.2 FAN3.2 HB.1 R17.1 R19.1 R21.1 R94.1 R95.1 R96.1 ; supply symbol labelled VHEAT
X_MAX: LPC1769.39(P1[25]/MC1A/MAT1[1]) X_MAX.3
X_MIN: LPC1769.38(P1[24]/MCFB2/PWM1[5]/MOSI0) X_MIN.3
Y_MAX: LPC1769.43(P1[27]/CLKOUT/USB_OVRCR/CAP0[1]) Y_MAX.3
Y_MIN: LPC1769.40(P1[26]/MC1B/PWM1[6]/CAP0[0]) Y_MIN.3
Z_MAX: LPC1769.45(P1[29]/MC2B/PCAP1[1]/MAT0[1]) Z_MAX.3
Z_MIN: LPC1769.44(P1[28]/MC2A/PCAP1[0]/MAT0[0]) Z_MIN.3
Unconnected: AD5206.10(B5) AD5206.11(W5) AD5206.12(A5) FET_DRV2.4 FET_DRV2.5 IC2.7(NC) IC2.20(NC) IC2.25(NC) IC3.7(NC) IC3.20(NC) IC3.25(NC) IC4.7(NC) IC4.20(NC) IC4.25(NC) IC5.7(NC) IC5.20(NC) IC5.25(NC) IC6.7(NC) IC6.20(NC) IC6.25(NC) IC7.2(DTR) IC7.3(RTS) IC7.6(RI) IC7.9(DSR) IC7.10(DCD) IC7.11(CTS) IC7.12(SLEEP) IC7.13(TXDEN) IC7.14(PWREN) IC7.19(RESET) IC7.27(OSCI) IC7.28(OSCO) IC8.5(!ON/OFF) IC9.5(B:+IN) IC9.6(B:-IN) IC9.7(B:OUT) LPC1769.13(N.C.) LPC1769.16(RTCX1) LPC1769.18(RTCX2) LPC1769.35(P1[21]/MCABORT/PWM1[3]/SSEL0) U2.1(NC) U2.8(RSV) U2.CD1(SHIELD) U2.CD2(SHIELD) U4.1(NC) U$7.ID

## Notes on the sheet
- ETHERNET | X AXIS | ENDSTOPS | FANS | HEATERS
- THERMISTORS
- PANEL CONNECTOR | POWER
- SD CARD | MICROCONTROLER
- X AXIS | X AXIS | X AXIS | X AXIS
- DEBUG PORT
- USB IN
- DIGITAL POTS | MECHANICAL | BUTTONS

## Library data of the parts
3V3 +5V LED2-LED4 LED6-LED8 RX TX = adafruit:LED: LED OSRAM: - CHIPLED LG R971, LG N971, LY N971, LG Q971, LY Q971, LO R971, LY R971 LH N974, LH R974 LS Q976, LO Q976, LY Q976 LO Q996 - Hyper CHIPLED LW Q18S LB Q993, LB Q99A, LB R99A - SideLED LS A670, LO A670, LY A670, LG A670, LP A670 LB A673, LV A673, LT A673, LW A673 LH A674 LY A675 LS A676, LA A676, LO A676, LY A676, LW A676 LS A679, LY A679, LG A679 - Hyper Micro SIDELED® LS Y876, LA Y876, LO Y876, LY Y876 LT Y87S - SmartLED LW L88C, LW L88S LB L89C, LB L89S, LG L890 LS L89K, LO L89K, LY L89K LS L896, LA L896, LO L896, LY L896 - TOPLED LS T670, LO T670, LY T670, LG T670, LP T670 LSG T670, LSP T670, LSY T670, LOP T670, LYG T670 LG T671, LOG T671, LSG T671 LB T673, LV T673, LT T673, LW T673 LH T674 LS T676, LA T676, LO T676, LY T676, LB T676, LH T676, LSB T676, LW T676 LB T67C, LV T67C, LT T67C, LS T67K, LO T67K, LY T67K, LW E67C LS E67B, LA E67B, LO E67B, LY E67B, LB E67C, LV E67C, LT E67C LW T67C LS T679, LY T679, LG T679 LS T770, LO T770, LY T770, LG T770, LP T770 LB T773, LV T773, LT T773, LW T773 LH T774 LS E675, LA E675, LY E675, LS T675 LS T776, LA T776, LO T776, LY T776, LB T776 LHGB T686 LT T68C, LB T68C - Hyper Mini TOPLED® LB M676 - Mini TOPLED Santana® LG M470 LS M47K, LO M47K, LY M47K Source: http://www.osram.convergy.de/
AD5206 = analog-devices:AD5206
C1-C10 C12 C13 C15-C22 C24-C32 C34-C39 C41-C46 C48-C53 C55 C57-C59 C62-C72 C75 C77 C79 C82-C86 = rcl:C-EU: CAPACITOR, European symbol
C11 C14 C56 C60 C61 C73 = SparkFun:CAP_POL: Capacitor Polarized These are standard SMD and PTH capacitors. Normally 10uF, 47uF, and 100uF in electrolytic and tantalum varieties. Always verify the external diameter of the through hole cap, it varies with capacity, voltage, and manufacturer. The EIA devices should be standard.
C23 C33 C40 C47 C54 C74 C78 = rcl:CPOL-EU: POLARIZED CAPACITOR, European symbol
C76 = microbuilder:CAP_TANTALUM: Tantalum Capacitors Wave footprints have larger pads and are meant to be used for hand soldering. Reflow footprints are optimised for solder paste and a reflow oven. EIA3216-18/A-[R/W] - Size A / 3216-18 / 1206 footprint 4.7µF 25V 10% Tantalum Capacitor 10µF 16V 10% Tantalum Capacitor [Digikey: 495-2236-2-ND] EIA3528-21/B-[R/W] - Size B / 3528-21 47µF 10V 10% Tantalum Capactior [Digikey: 495-2216-1-ND] EIA6032-28/C-[R/W] - Size C / 6032-28 10µF 35V 20% Tantalum Capacitor [Digikey: 495-2285-1-ND] 100µF 16V 10% Tantalum Capactior [Digikey: 399-5214-1-ND]
D1-D3 = diode:DIODE-: DIODE
E0 E1 HB V_HEAT V_MOT = con-wago-500:W237-102: WAGO SCREW CLAMP; MPN: 237-102; OC_FARNELL: unknown; OC_NEWARK: 70K9898
E0_AXIS E1_AXIS X_AXIS Y_AXIS Z_AXIS = con-molex:22-23-2041: .100" (2.54mm) Center Header - 4 Pin; MF: MOLEX; MPN: 22-23-2041; OC_FARNELL: 1462920; OC_NEWARK: 38C0355
E0_FET E1_FET HOTBET_FET = transistor-power:IRLR8743
END_STOP_V = SparkFun:SOLDERJUMPER_2WAY: Solder Jumper 2 way solder jumper
F1 F2 L4 = rcl:L-EU: INDUCTOR, European symbol
F3 = _hhn_littlefuse_Nano2SMF_2:SMF_OMNIBLOK_154: Littlefuse SMF OMNI-BLOK (R) Fuse Holder with Installed Fuse (NANO2 SMF): Series 154 Source: http://www.littlefuse.com Technologies (ROHS-compliant): Very Fast-Acting Fuse Installed: 154.x = rating x mA 154 0[..]y = rating y A Slow-Acting Fuse Installed (Slo-Blo (R)) 154.xT = rating x mA 154 0[..]yT = rating y A Author: Dipl.-Ing. FH Rainer Bayer HHN Hochschule Heilbronn, rainer.bayer@hs-heilbronn.de Ingenieurbüro ing-rb, mail@ing-rb.de
F4 = Littelfuse_By_element14_Batch_1:01530008Z
FAN1-FAN3 T_E0 T_E1 T_HB = con-molex:22-23-2021: .100" (2.54mm) Center Header - 2 Pin; MF: MOLEX; MPN: 22-23-2021; OC_FARNELL: 1462926; OC_NEWARK: 25C3832
FB1-FB3 = microbuilder:FERRITE: Ferrite Bead 0603 MMZ1608B121C - 120 Ohm @ 100MHz, 600mA, 0.15 Ohm DC Resistance - Digikey: 445-2164-1-ND BK1608HW121-T - 120 Ohm, 600mA Ferrite Chip - Digikey: 587-1876-2-ND 0805 HZ0805B272R-10 - 2.7K Ohm @ 100MHz, 200mA, 0.8 Ohm DC Resistance - Digikey: 240-2504-1-ND (see also Murata BLM21BD272SN1L) MMZ2012Y152B - 1.5K Ohm @ 100MHz, 500mA, 0.4 Ohm DC Resistance - Digikey: 445-1560-1-ND - Mainly for high frequency (80-400MHz) MMZ2012R102A - 1K Ohm @ 100MHz, 500mA, 0.3 Ohm DC Resistance - Digikey: 445-1555-2-ND - More general purpose (10-200MHz)
FET_DRV1 FET_DRV2 = custom_esorensen:TC4427
GND U$17 U$18 U$20 = microbuilder:MOUNTINGHOLE: Mounting Hole For #2 screws (0.086"/2.18mm width, 0.094"/2.4mm hole) use 2.5mm
IC2-IC6 = allegro:A4983: DMOS Microstepping Driver with Translator Auto generated by make-symbol-device-package-bsdl.ulp Rev. 32 Source: http://www.allegromicro.com/en/Products/Part_Numbers/4983/4983.pdf; MPN: A4983SETTR-T; OC_FARNELL: 1688956; OC_NEWARK: 39M6763
IC7 = SparkFun:FT232RL: USB UART FT232RL 4th Generation USB UART (USB <-> Serial) Controller. Spark Fun Electronics SKU : COM-00650
IC8 = LM2675:LM2675
IC9 = linear:LMV358?*: Dual General Purpose, Low Voltage, Rail-to-Rail Output Operational Amplifiers Source: http://www.national.com/mpf/LM/LMV321.html http://www.national.com/dt/lmv_qual.pdf
IC10 = lm1117:LM1117IMPX-*
L2 = SparkFun:INDUCTOR: Inductors Basic Inductor/Choke - 0603 and 1206. Footprints are not proven and vary greatly between part numbers.
LPC1769 = microbuilder:LPC1768: LPC1768 100 MHz 32-bit ARM Cortex-M3 based microcontroller featuring a high level of integration and low power consumption. 512 kB Flash, 64 kB SRAM, USB Device/Host/OTG, Ethernet, CAN, I2S, 10-bit DAC Digikey: 568-4796-ND
MS1-MS15 = SparkFun:SOLDERJUMPER: Solder Jumper Standard SMD solder jumper. Used to automate production. Two varients : Normally Open and Normally Closed are the same, but have different paste layers. NC will have a large amount of paste and should jumper during reflow.
PANEL = con-3m:2520-: 3M (TM) Pak 100 4-Wall Header Source: 3M; OC_FARNELL: unknown; OC_NEWARK: unknown
PLAY PROGRAM RESET = SparkFun:TAC_SWITCH: Momentary Switch Button commonly used for reset or general input. Spark Fun Electronics SKU : COM-00097
Q1 = transistor-pnp:BC857*: PNP Transistror
Q2-Q4 = transistor-fet:IRLHM630PBF
R1-R83 R88-R91 R94-R96 = rcl:R-EU_: RESISTOR, European symbol
R97 R98 = varistor:VARISTOR: VARISTOR
RJ1 = con-j0011d21b-v3:J0011D21B
T1 = zetex:PMOSSOT23: MOS FET; OC_FARNELL: unknown; OC_NEWARK: unknown
U2 = SparkFun:USD-SOCKET: microSD Socket Push-push type uSD socket. Schematic element and footprint production proven. Spark Fun Electronics SKU : PRT-00127. tDoc lines correctly indicate media card edge positions when inserting (unlocked, locked, depressed).
U3 = microbuilder:LAN8720: LAN8720A 10/100 Ethernet PHY Mouser: 886-LAN8720AI-CP
U4 = microbuilder:74LVC1G04: 74LVC1G04 - Single Inverter Gate SOT23-5 SN74LVC1G04DBVR - Digikey: 296-11599-1-ND
U$1 = SparkFun:USB+SHIELD: USB+Shield USB connector with shield pins connectable
U$3 U$8 = SparkFun:CRYSTAL2734
U$7 = SparkFun:USB-MINIB: Mini-USB "B" connector with 5th pin broken out. Created new symbol breaking out 5th "ID" pin in mini/micro USB connector spec. See: http://en.wikipedia.org/wiki/Mini_usb#Cables. Uses same footprint as 4-pin symbol. Also added pins to connect to mounting / shield pads if required (probably not generally needed as signals aren't shielded once they leave the connector).
U$21 = adafruit:SUNLOGO: Just a SMT logo of a sun. cute!
U$22 U$23 = adafruit:FIDUCIAL: For use by pick and place machines to calibrate the vision/machine, 1mm By microbuilder.eu
X_MAX X_MIN Y_MAX Y_MIN Z_MAX Z_MIN = con-molex:22-23-2031: .100" (2.54mm) Center Header - 3 Pin; MF: MOLEX; MPN: 22-23-2031; OC_FARNELL: 1462950; OC_NEWARK: 30C0862